# Altium schematic sheet Analog_Sensors_Sheet.SchDoc
size A2; SheetNumber: 3; SheetTotal: 6
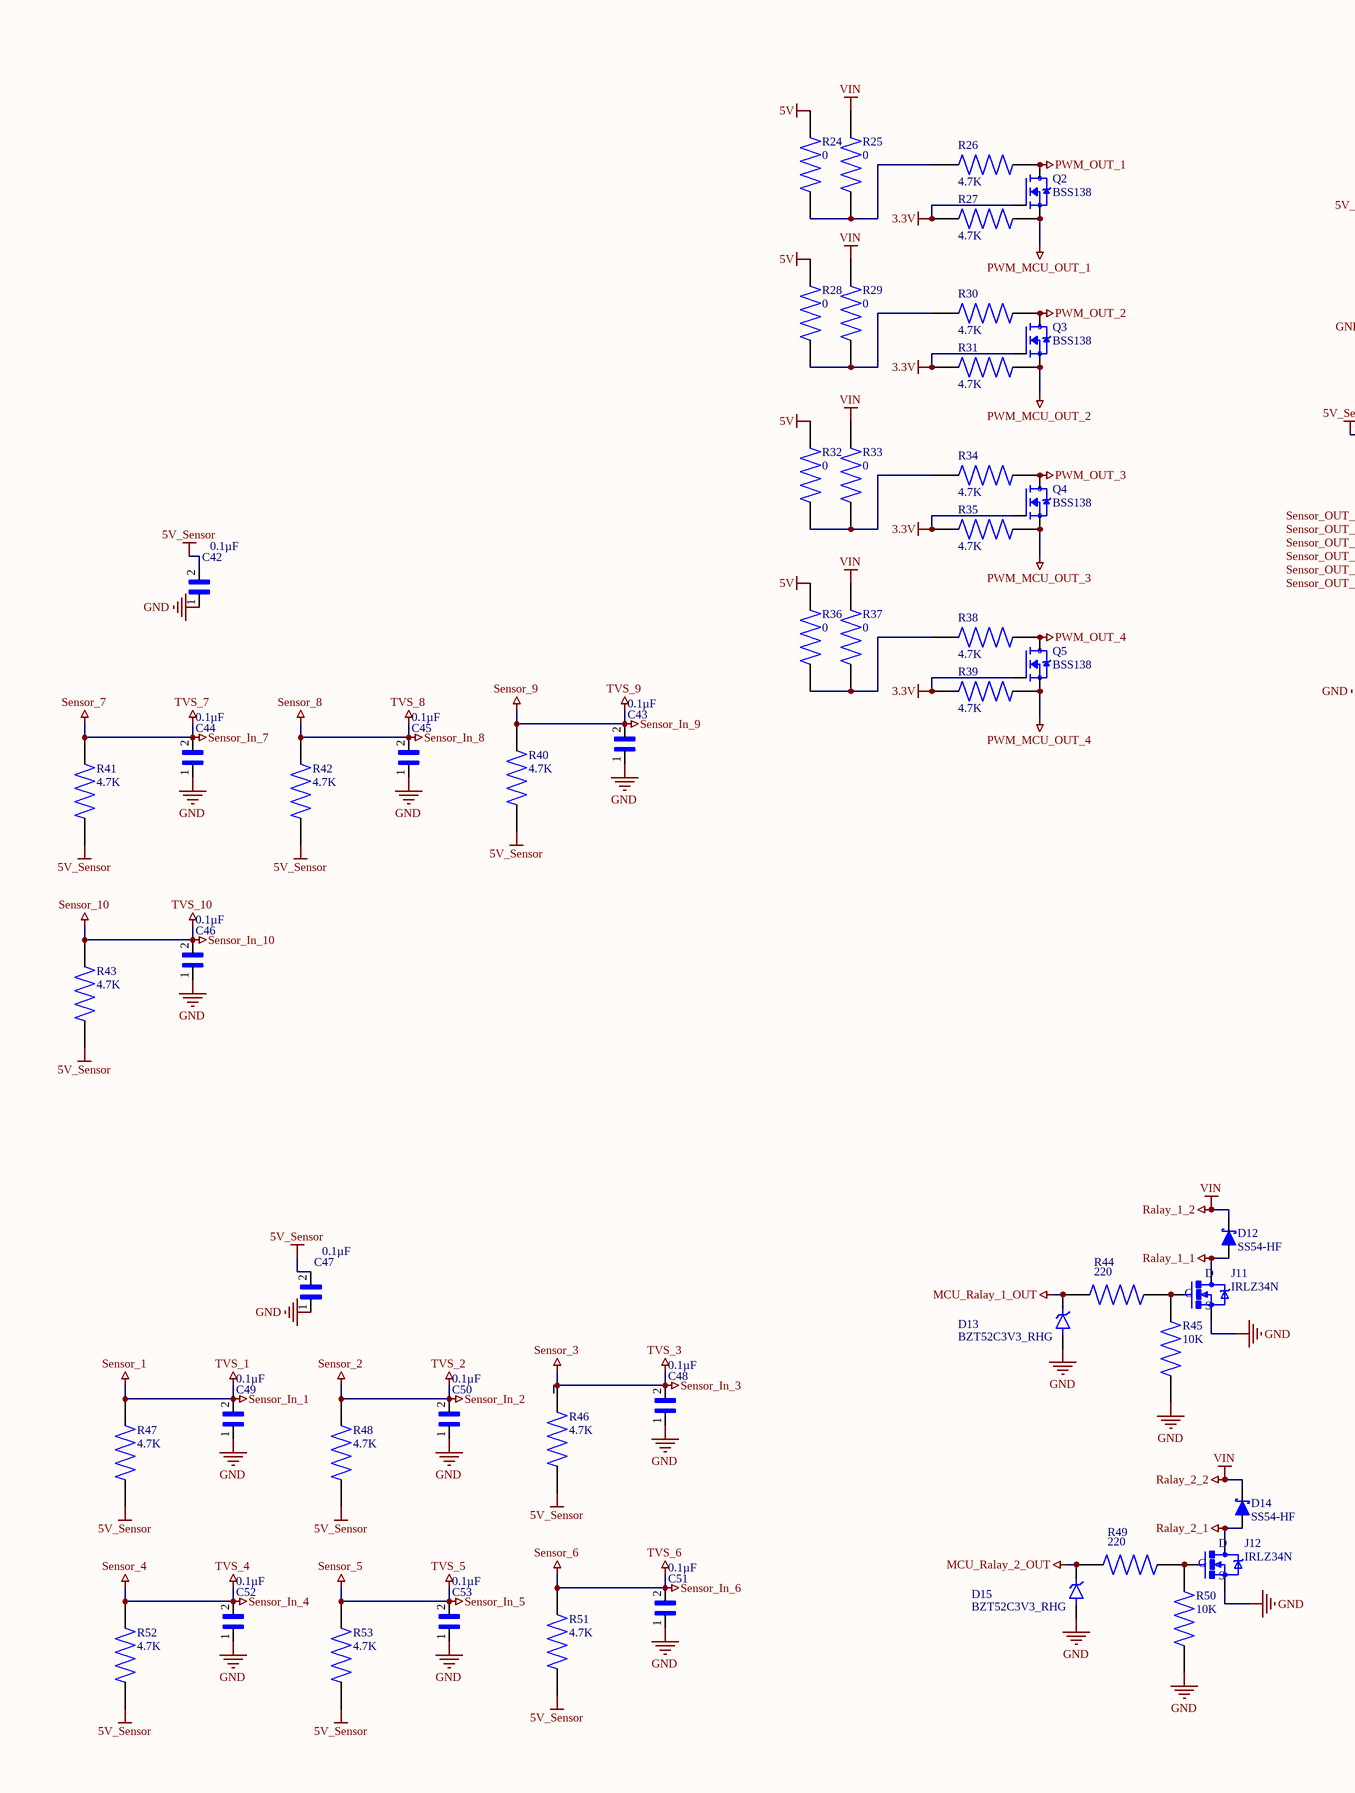
[diagram p0: Analog_Sensors_Sheet.SchDoc, left]
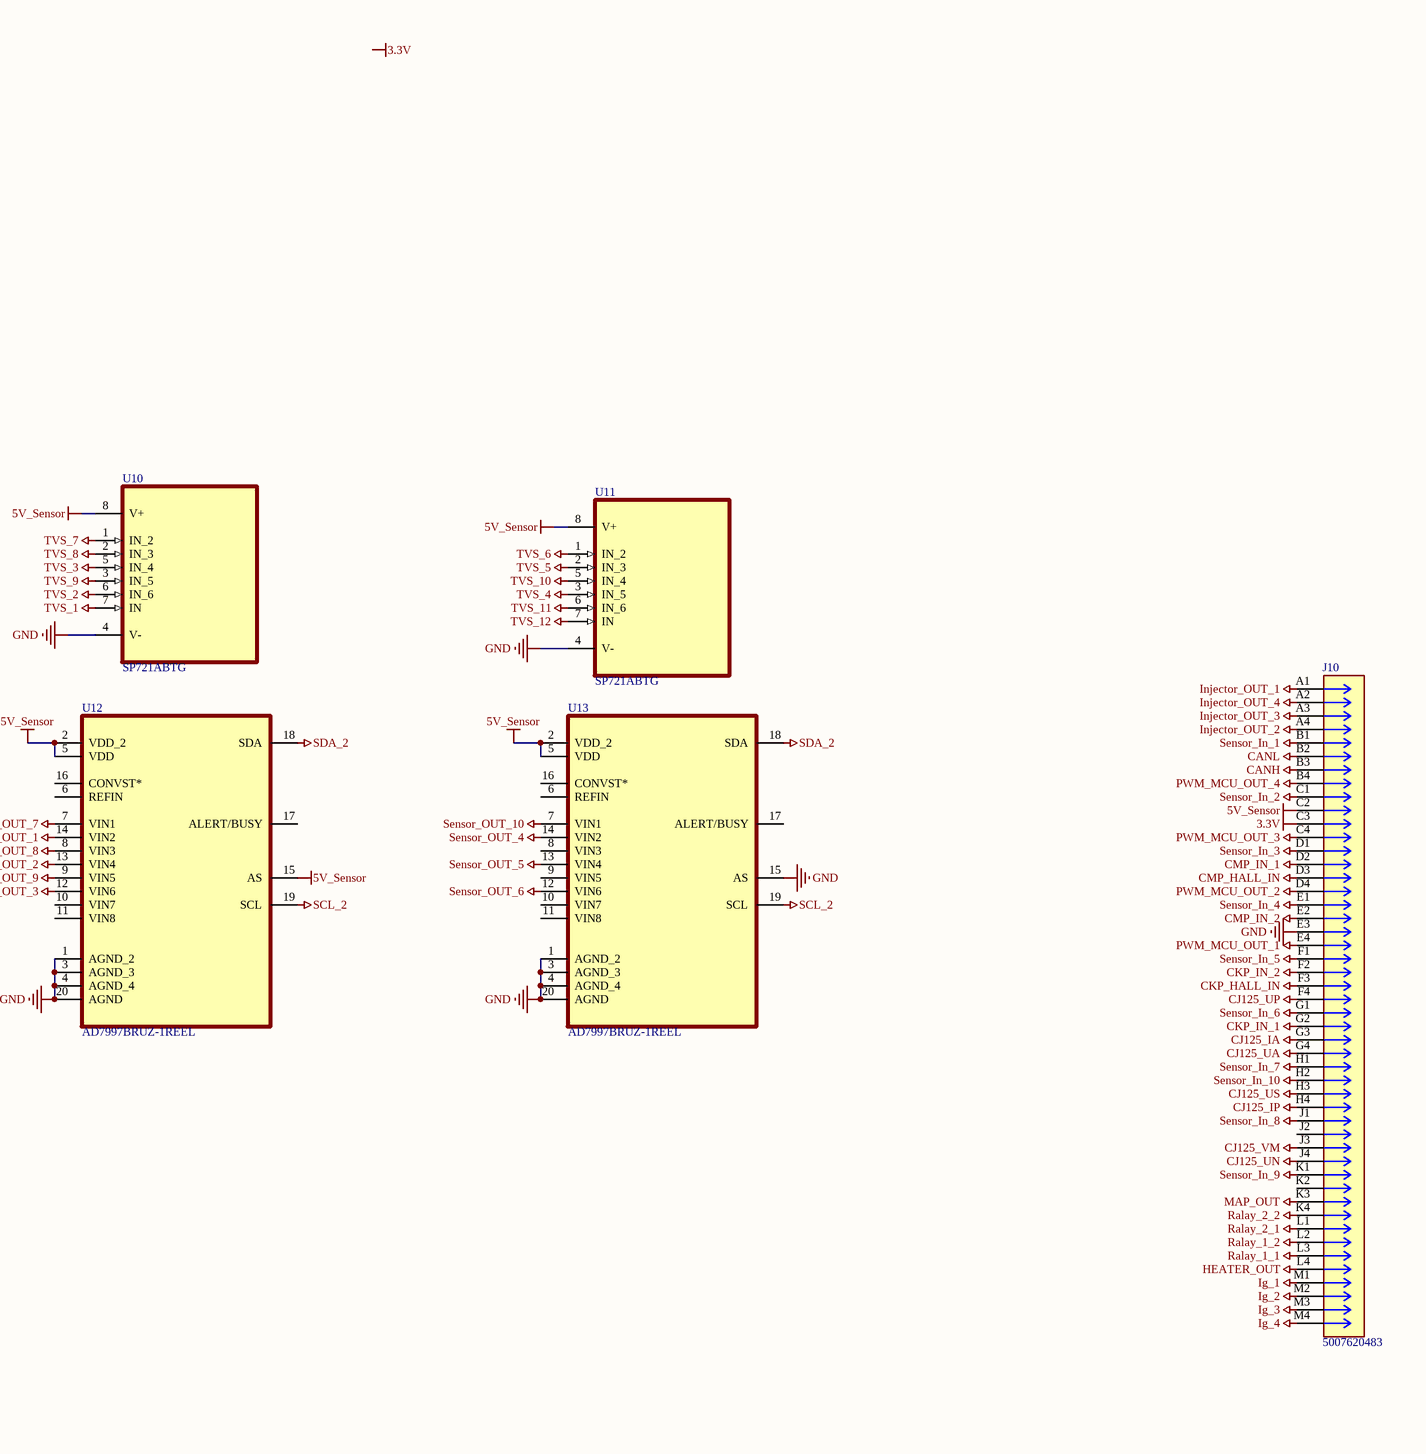
[diagram p1: Analog_Sensors_Sheet.SchDoc, right]

## Parts
C42  0.1µF  [CAPC1608X90N]
C43  0.1µF  [CAPC1608X90N]
C44  0.1µF  [CAPC1608X90N]
C45  0.1µF  [CAPC1608X90N]
C46  0.1µF  [CAPC1608X90N]
C47  0.1µF  [CAPC1608X90N]
C48  0.1µF  [CAPC1608X90N]
C49  0.1µF  [CAPC1608X90N]
C50  0.1µF  [CAPC1608X90N]
C51  0.1µF  [CAPC1608X90N]
C52  0.1µF  [CAPC1608X90N]
C53  0.1µF  [CAPC1608X90N]
D12  SS54-HF  [DIOM5025X220N]
D13  BZT52C3V3_RHG  [DIO_BZT52C3V3_RHG]
D14  SS54-HF  [DIOM5025X220N]
D15  BZT52C3V3_RHG  [DIO_BZT52C3V3_RHG]
J10  5007620483  [CONN_SD-500762-001_MOL]
J11  IRLZ34N  [TO-220(2)]
J12  IRLZ34N  [TO-220(2)]
Q2  BSS138  [SOT95P240X111-3N]
Q3  BSS138  [SOT95P240X111-3N]
Q4  BSS138  [SOT95P240X111-3N]
Q5  BSS138  [SOT95P240X111-3N]
R24  0  [RESC3116X65N]
R25  0  [RESC3116X65N]
R26  4.7K  [RESC3116X65N]
R27  4.7K  [RESC3116X65N]
R28  0  [RESC3116X65N]
R29  0  [RESC3116X65N]
R30  4.7K  [RESC3116X65N]
R31  4.7K  [RESC3116X65N]
R32  0  [RESC3116X65N]
R33  0  [RESC3116X65N]
R34  4.7K  [RESC3116X65N]
R35  4.7K  [RESC3116X65N]
R36  0  [RESC3116X65N]
R37  0  [RESC3116X65N]
R38  4.7K  [RESC3116X65N]
R39  4.7K  [RESC3116X65N]
R40  4.7K  [RESC3116X65N]
R41  4.7K  [RESC3116X65N]
R42  4.7K  [RESC3116X65N]
R43  4.7K  [RESC3116X65N]
R44  220  [RESC3116X65N]
R45  10K  [RESC3116X65N]
R46  4.7K  [RESC3116X65N]
R47  4.7K  [RESC3116X65N]
R48  4.7K  [RESC3116X65N]
R49  220  [RESC3116X65N]
R50  10K  [RESC3116X65N]
R51  4.7K  [RESC3116X65N]
R52  4.7K  [RESC3116X65N]
R53  4.7K  [RESC3116X65N]
U10  SP721ABTG  [SOIC127P600X175-8N]
U11  SP721ABTG  [SOIC127P600X175-8N]
U12  AD7997BRUZ-1REEL  [SOP65P640X120-20N]
U13  AD7997BRUZ-1REEL  [SOP65P640X120-20N]

## Nets
3.3V: J10.C3 Q2.1(G) Q3.1(G) Q4.1(G) Q5.1(G) R27.2 R31.2 R35.2 R39.2
5V: R24.2 R28.2 R32.2 R36.2
5V_Sensor: C42.2 C47.2 J10.C2 R40.1 R41.1 R42.1 R43.1 R46.1 R47.1 R48.1 R51.1 R52.1 R53.1 U10.8(V+) U11.8(V+) U12.2(VDD_2) U12.5(VDD) U12.15(AS) U13.2(VDD_2) U13.5(VDD)
CANH: J10.B3
CANL: J10.B2
CJ125_IA: J10.G3
CJ125_IP: J10.H4
CJ125_UA: J10.G4
CJ125_UN: J10.J4
CJ125_UP: J10.F4
CJ125_US: J10.H3
CJ125_VM: J10.J3
CKP_HALL_IN: J10.F3
CKP_IN_1: J10.G2
CKP_IN_2: J10.F2
CMP_HALL_IN: J10.D3
CMP_IN_1: J10.D2
CMP_IN_2: J10.E2
GND: C42.1 C43.1 C44.1 C45.1 C46.1 C47.1 C48.1 C49.1 C50.1 C51.1 C52.1 C53.1 D13.A D15.A J10.E3 J11.OUT(S) J12.OUT(S) R45.2 R50.2 U10.4(V-) U11.4(V-) U12.1(AGND_2) U12.3(AGND_3) U12.4(AGND_4) U12.20(AGND) U13.1(AGND_2) U13.3(AGND_3) U13.4(AGND_4) U13.15(AS) U13.20(AGND)
HEATER_OUT: J10.L4
Ig_1: J10.M1
Ig_2: J10.M2
Ig_3: J10.M3
Ig_4: J10.M4
Injector_OUT_1: J10.A1
Injector_OUT_2: J10.A4
Injector_OUT_3: J10.A3
Injector_OUT_4: J10.A2
MAP_OUT: J10.K3
MCU_Ralay_1_OUT: D13.C(K) R44.1
MCU_Ralay_2_OUT: D15.C(K) R49.1
PWM_MCU_OUT_1: J10.E4 Q2.2(S) R27.1
PWM_MCU_OUT_2: J10.D4 Q3.2(S) R31.1
PWM_MCU_OUT_3: J10.C4 Q4.2(S) R35.1
PWM_MCU_OUT_4: J10.B4 Q5.2(S) R39.1
PWM_OUT_1: Q2.3(D) R26.1
PWM_OUT_2: Q3.3(D) R30.1
PWM_OUT_3: Q4.3(D) R34.1
PWM_OUT_4: Q5.3(D) R38.1
Ralay_1_1: D12.2(A) J10.L3 J11.GND(D)
Ralay_1_2: D12.1(K) D14.1(K) J10.K4 J10.L2 R25.2 R29.2 R33.2 R37.2  [also labelled Ralay_2_2, VIN]
Ralay_2_1: D14.2(A) J10.L1 J12.GND(D)
SCL_2: U12.19(SCL) U13.19(SCL)
SDA_2: U12.18(SDA) U13.18(SDA)
Sensor_1: C49.2 J10.B1 R47.2 U10.7(IN)  [also labelled Sensor_In_1, TVS_1]
Sensor_2: C50.2 J10.C1 R48.2 U10.6(IN_6)  [also labelled Sensor_In_2, TVS_2]
Sensor_3: C48.2 J10.D1 R46.2 U10.5(IN_4)  [also labelled Sensor_In_3, TVS_3]
Sensor_4: C52.2 J10.E1 R52.2 U11.3(IN_5)  [also labelled Sensor_In_4, TVS_4]
Sensor_5: C53.2 J10.F1 R53.2 U11.2(IN_3)  [also labelled Sensor_In_5, TVS_5]
Sensor_6: C51.2 J10.G1 R51.2 U11.1(IN_2)  [also labelled Sensor_In_6, TVS_6]
Sensor_7: C44.2 J10.H1 R41.2 U10.1(IN_2)  [also labelled Sensor_In_7, TVS_7]
Sensor_8: C45.2 J10.J1 R42.2 U10.2(IN_3)  [also labelled Sensor_In_8, TVS_8]
Sensor_9: C43.2 J10.K1 R40.2 U10.3(IN_5)  [also labelled Sensor_In_9, TVS_9]
Sensor_10: C46.2 J10.H2 R43.2 U11.5(IN_4)  [also labelled Sensor_In_10, TVS_10]
Sensor_OUT_1: U12.14(VIN2)
Sensor_OUT_2: U12.13(VIN4)
Sensor_OUT_3: U12.12(VIN6)
Sensor_OUT_4: U13.14(VIN2)
Sensor_OUT_5: U13.13(VIN4)
Sensor_OUT_6: U13.12(VIN6)
Sensor_OUT_7: U12.7(VIN1)
Sensor_OUT_8: U12.8(VIN3)
Sensor_OUT_9: U12.9(VIN5)
Sensor_OUT_10: U13.7(VIN1)
TVS_11: U11.6(IN_6)
TVS_12: U11.7(IN)
NetJ11_IN: J11.IN(G) R44.2 R45.1
NetJ12_IN: J12.IN(G) R49.2 R50.1
NetR24_1: R24.1 R25.1 R26.2
NetR28_1: R28.1 R29.1 R30.2
NetR32_1: R32.1 R33.1 R34.2
NetR36_1: R36.1 R37.1 R38.2

Not connected (* = marked no-connect by the designer): J10 J2 K2; U12 6(REFIN) 10(VIN7) 11(VIN8) 16(CONVST*) 17(ALERT/BUSY); U13 6(REFIN) 8(VIN3) 9(VIN5) 10(VIN7) 11(VIN8) 16(CONVST*) 17(ALERT/BUSY)

## Notes on the sheet
- Labels drawn without touching a wire or pin: 3.3V

## Library data of the parts
C42-C53 = 06035C104MAZ2A: Multilayer Ceramic Capacitors MLCC - SMD/SMT; Package: None; Price: None; Value: *; MP: 06035C104MAZ2A; Availability: Unavailable
D12 D14 = SS54-HF: Diode Schottky 40 V 5A Surface Mount DO-214AC (SMA); MF: Comchip Technology; SnapEDA_Link: https://www.snapeda.com/parts/SS54-HF/Comchip/view-part/?ref=snap; Package: DO-214AC-214 Comchip Technology; Value: *; MP: SS54-HF; Check_prices: https://www.snapeda.com/parts/SS54-HF/Comchip/view-part/?ref=eda
J11 J12 = IRLZ34N: N-Channel 55 V 30A (Tc) 3.8W (Ta), 68W (Tc) Surface Mount D2PAK; MF: Infineon; SnapEDA_Link: https://www.snapeda.com/parts/IRLZ34N/Infineon/view-part/?ref=snap; Package: TO-220 Infineon; Value: *; MP: IRLZ34N; Check_prices: https://www.snapeda.com/parts/IRLZ34N/Infineon/view-part/?ref=eda
Q2-Q5 = BSS138: N-Channel 50 V 220mA (Ta) 350mW (Ta) Surface Mount SOT-23-3; MF: onsemi; SnapEDA_Link: https://www.snapeda.com/parts/BSS138/Onsemi/view-part/?ref=snap; Package: SOT-23-3 ON Semiconductor; Value: *; MP: BSS138; Check_prices: https://www.snapeda.com/parts/BSS138/Onsemi/view-part/?ref=eda
R24-R43 R46-R48 R51-R53 = RC1206FR-074K7L: 4.7 kOhms Â±1% 0.25W, 1/4W Chip Resistor 1206 (3216 Metric) Moisture Resistant Thick Film; MF: Yageo; SnapEDA_Link: https://www.snapeda.com/parts/RC1206FR-074K7L/Yageo/view-part/?ref=snap; Package: 3116 Yageo; Value: *; MP: RC1206FR-074K7L; Check_prices: https://www.snapeda.com/parts/RC1206FR-074K7L/Yageo/view-part/?ref=eda
R44 R45 R49 R50 = AA1206JR-07470RL: Package: None; Price: None; Value: *; MP: AA1206JR-07470RL; Availability: Unavailable
U10 U11 = SP721ABTG: TVS Diode Arrays; Package: None; Price: None; Value: *; MP: SP721ABTG; Availability: Unavailable
U12 U13 = AD7997BRUZ-1REEL: Adc, 10-Bit, 188Ksps, Tssop-20; Resolution (Bits):10Bit; Sampling Rate:188Ksps; Input Channel Type:Single Ended; Data Interface:2 Wire, I2C; Supply Voltage Type:Single; Supply Voltage Min:2.7V; Supply Voltage Max:5.5V Rohs Compliant: Yes |Analog Devices A; MP: AD7997BRUZ1; SnapEDA_Link: https://www.snapeda.com/parts/AD7997BRUZ1/Analog+Devices/view-part/?ref=snap; Package: None; Value: *; MF: Analog Devices; Check_prices: https://www.snapeda.com/parts/AD7997BRUZ1/Analog+Devices/view-part/?ref=eda
D13 D15 = BZT52C3V3_RHG: Package: None; Price: None; Value: *; MP: BZT52C3V3_RHG; Availability: Unavailable
J10 = 5007620483: Package: None; Price: None; Value: *; MP: 5007620483; Availability: Unavailable